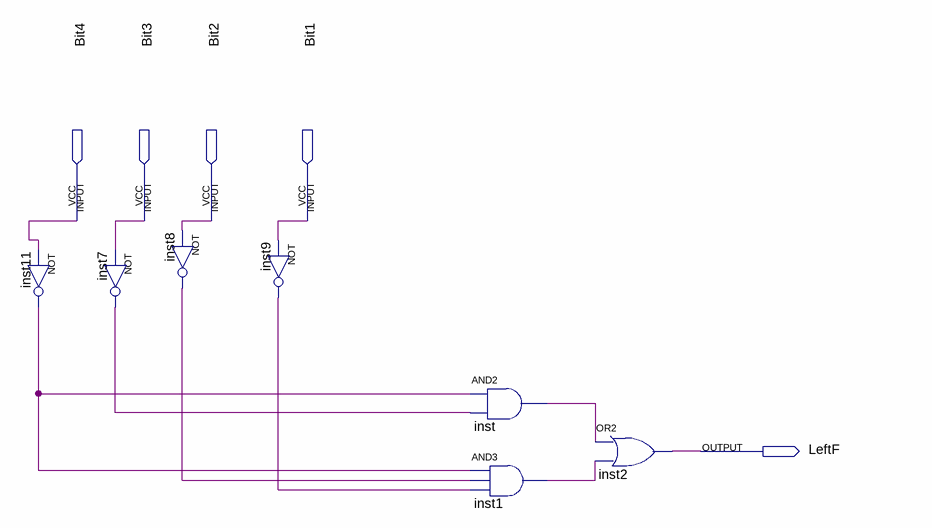
[diagram p0: schematic sheet]
// Quartus schematic LeftF.bdf as structural Verilog: 7 symbols, 5 pins
module LeftF (
  input  Bit4,
  input  Bit3,
  input  Bit2,
  input  Bit1,
  output LeftF
);

  wire inst1_out, inst7_out, inst8_out, inst9_out, inst11_out, inst_out;

  not inst11 (inst11_out, Bit4);
  not inst7 (inst7_out, Bit3);
  not inst8 (inst8_out, Bit2);
  not inst9 (inst9_out, Bit1);
  and inst (inst_out, inst11_out, inst7_out);
  and inst1 (inst1_out, inst11_out, inst8_out, inst9_out);
  or inst2 (LeftF, inst_out, inst1_out);
endmodule
